# Altium schematic sheet Digital_Connectors_and_IHM.SchDoc
size A3; SheetNumber: 3; SheetTotal: 4; SPICEModelCachePRCXJTIU: <root> / <DocumentId>PRCXJTIU</DocumentId> / </root>
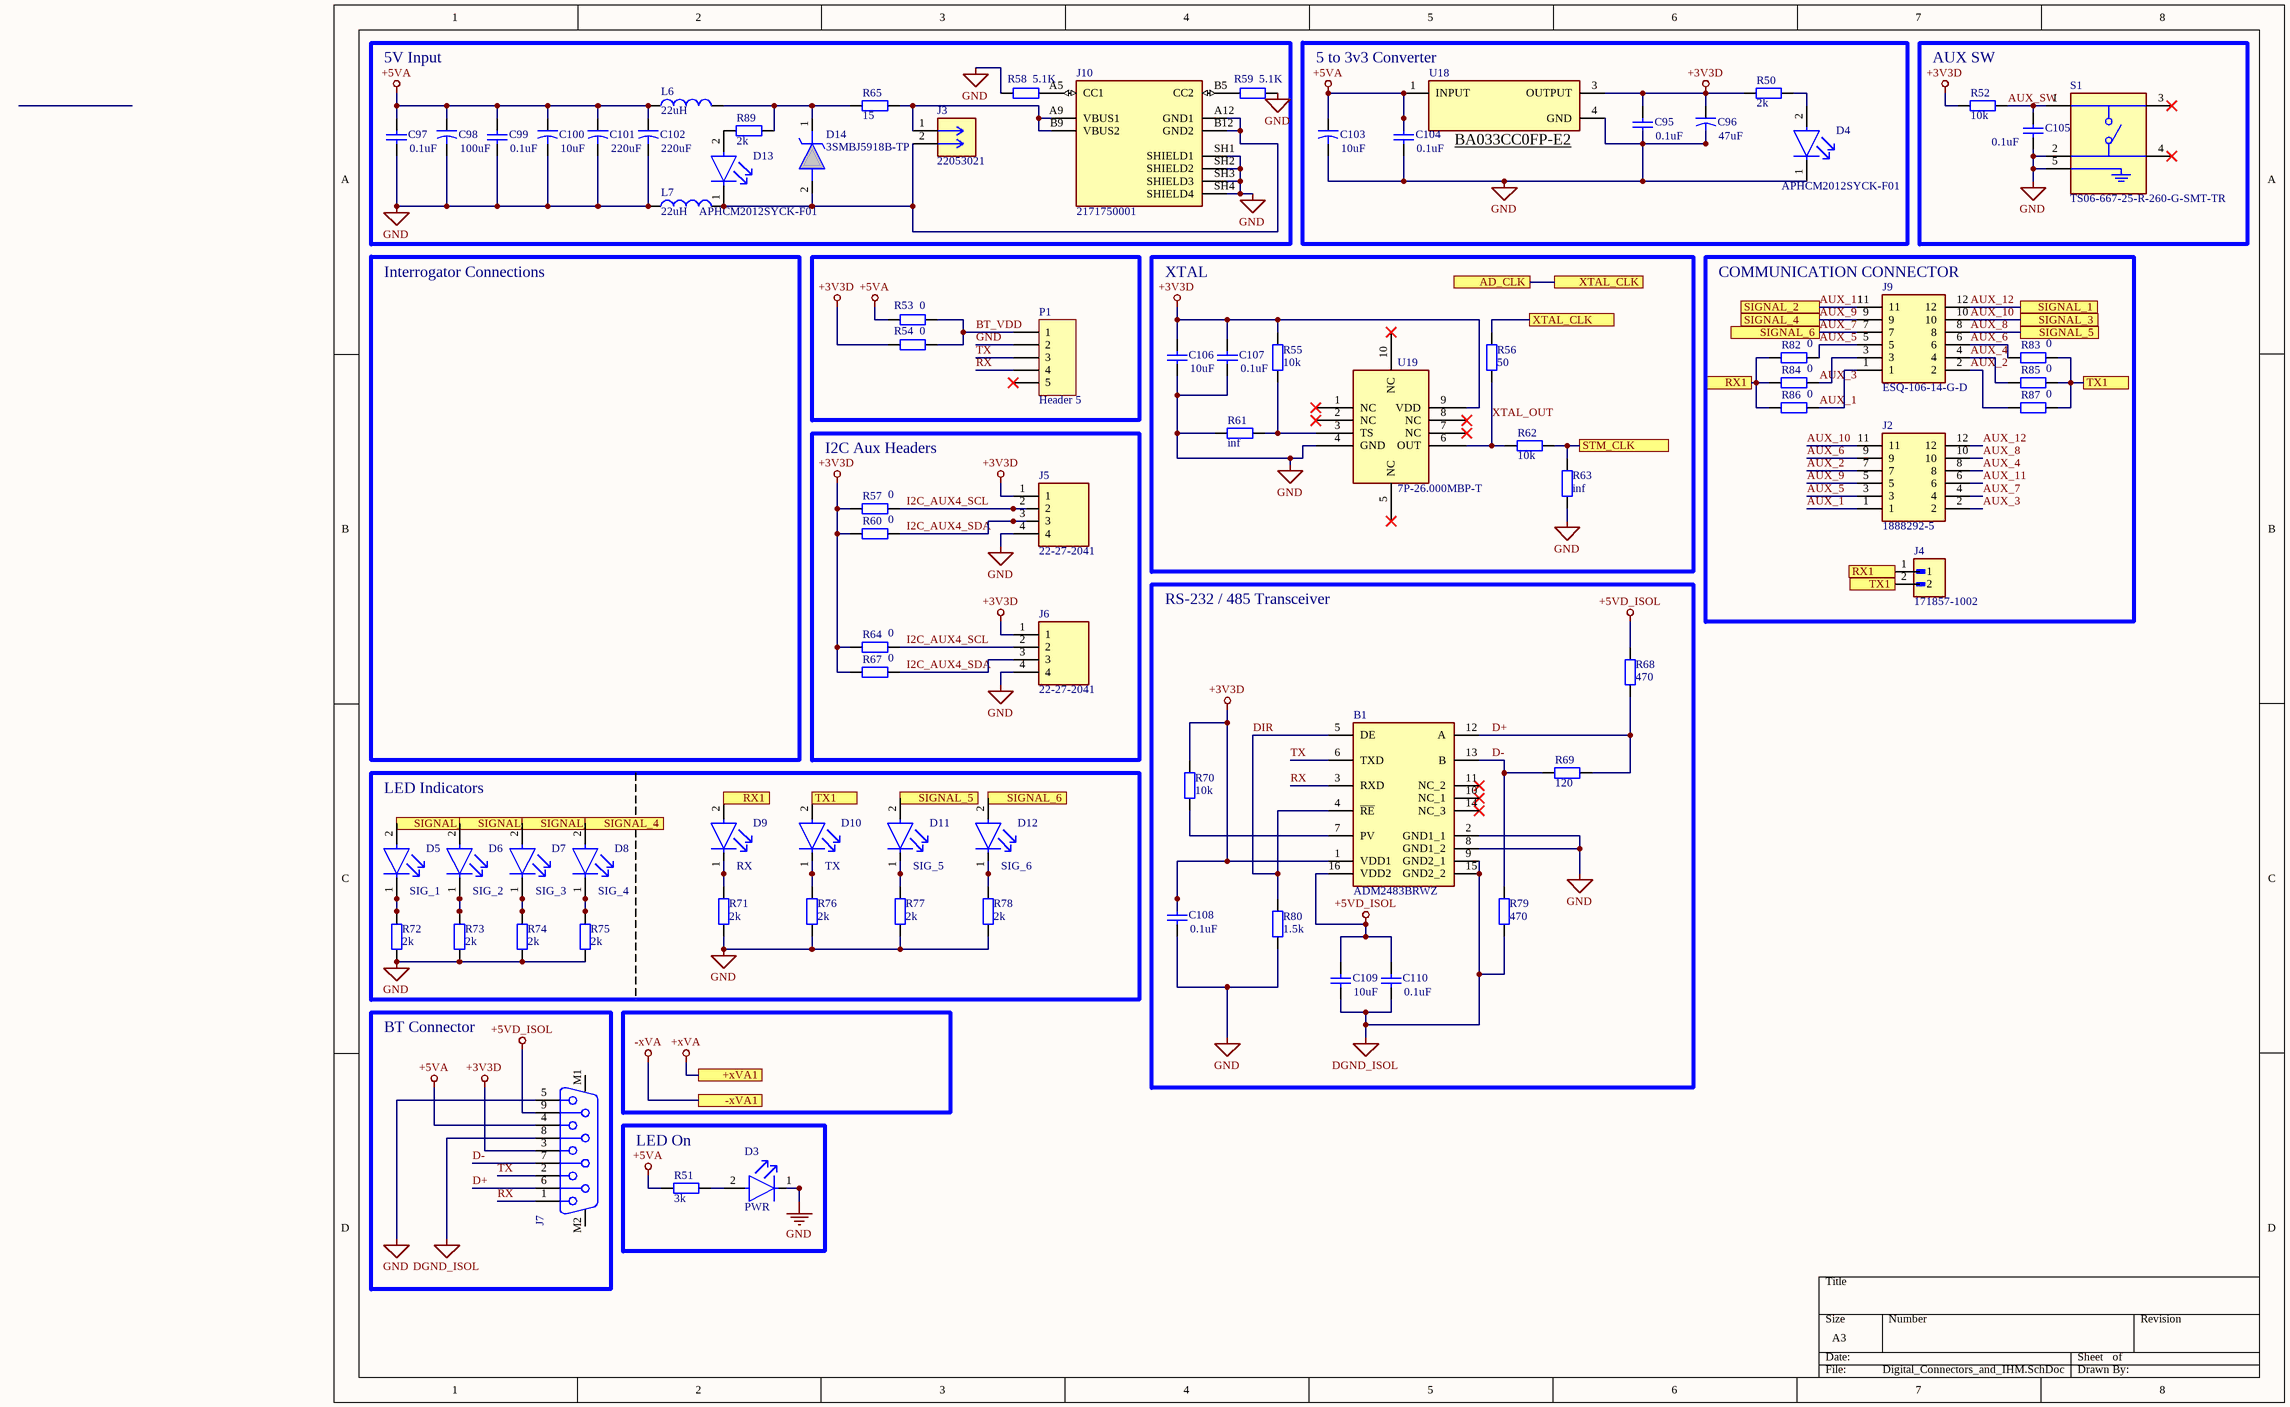
[diagram p0: Digital_Connectors_and_IHM.SchDoc]

## Parts
B1  ADM2483BRWZ  [ADM2483BRWZ]
C95  value 0.1uF  [CC_0805]  (hidden comment: Cap)
C96  value 47uF  [CC_0805]  (hidden comment: Cap2)
C97  value 0.1uF  [CC_0805]  (hidden comment: Cap)
C98  value 100uF  [CC_0805]  (hidden comment: Cap2)
C99  value 0.1uF  [CC_0805]  (hidden comment: Cap)
C100  value 10uF  [CC_0805]  (hidden comment: Cap2)
C101  value 220uF  [CC_0805]  (hidden comment: Cap2)
C102  value 220uF  [CC_0805]  (hidden comment: Cap2)
C103  value 10uF  [CC_0805]  (hidden comment: Cap2)
C104  value 0.1uF  [CC_0805]  (hidden comment: Cap)
C105  value 0.1uF  [CC_0805]  (hidden comment: Cap)
C106  value 10uF  [CC_0805]  (hidden comment: Cap)
C107  value 0.1uF  [CC_0805]  (hidden comment: Cap)
C108  value 0.1uF  [CC_0805]  (hidden comment: Cap)
C109  value 10uF  [CC_0805]  (hidden comment: Cap)
C110  value 0.1uF  [CC_0805]  (hidden comment: Cap)
D3  PWR  [FP-APHCM2012SYCK-F01-MFG]
D4  APHCM2012SYCK-F01  [FP-APHCM2012SYCK-F01-MFG]
D5  SIG_1  [FP-APHCM2012SYCK-F01-MFG]
D6  SIG_2  [FP-APHCM2012SYCK-F01-MFG]
D7  SIG_3  [FP-APHCM2012SYCK-F01-MFG]
D8  SIG_4  [FP-APHCM2012SYCK-F01-MFG]
D9  RX  [FP-APHCM2012SYCK-F01-MFG]
D10  TX  [FP-APHCM2012SYCK-F01-MFG]
D11  SIG_5  [FP-APHCM2012SYCK-F01-MFG]
D12  SIG_6  [FP-APHCM2012SYCK-F01-MFG]
D13  APHCM2012SYCK-F01  [FP-APHCM2012SYCK-F01-MFG]
D14  3SMBJ5918B-TP  [3SMBJ5918B-TP]
J2  1888292-5  [TE_1888292-5]
J3  22053021  [22-05-3021]
J4  171857-1002  [MOLEX_171857-1002]
J5  22-27-2041  [22-27-2041]
J6  22-27-2041  [22-27-2041]
J7  618009231121  [618009231121]  (value not drawn)
J9  ESQ-106-14-G-D  [ESQ-106-Y-X-D]
J10  2171750001  [MOLEX_2171750001]
L6  value 22uH  [WE-PMI_0805_H0.5]  (hidden comment: Inductor)
L7  value 22uH  [WE-PMI_0805_H0.5]  (hidden comment: Inductor)
P1  Header 5  [HDR1X5]
R50  value 2k  [RR_1220]  (hidden comment: Res2)
R51  value 3k  [RR_1220]  (hidden comment: Res2)
R52  value 10k  [RR_1220]  (hidden comment: Res2)
R53  value 0  [RR_1220]  (hidden comment: Res2)
R54  value 0  [RR_1220]  (hidden comment: Res2)
R55  value 10k  [RR_1220]  (hidden comment: Res2)
R56  value 50  [RR_1220]  (hidden comment: Res2)
R57  value 0  [RR_1220]  (hidden comment: Res2)
R58  value 5.1K  [RR_1220]  (hidden comment: Res2)
R59  value 5.1K  [RR_1220]  (hidden comment: Res2)
R60  value 0  [RR_1220]  (hidden comment: Res2)
R61  value inf  [RR_1220]  (hidden comment: Res2)
R62  value 10k  [RR_1220]  (hidden comment: Res2)
R63  value inf  [RR_1220]  (hidden comment: Res2)
R64  value 0  [RR_1220]  (hidden comment: Res2)
R65  value 15  [RR_1220]  (hidden comment: Res2)
R67  value 0  [RR_1220]  (hidden comment: Res2)
R68  value 470  [RR_1220]  (hidden comment: Res2)
R69  value 120  [RR_1220]  (hidden comment: Res2)
R70  value 10k  [RR_1220]  (hidden comment: Res2)
R71  value 2k  [RR_1220]  (hidden comment: Res2)
R72  value 2k  [RR_1220]  (hidden comment: Res2)
R73  value 2k  [RR_1220]  (hidden comment: Res2)
R74  value 2k  [RR_1220]  (hidden comment: Res2)
R75  value 2k  [RR_1220]  (hidden comment: Res2)
R76  value 2k  [RR_1220]  (hidden comment: Res2)
R77  value 2k  [RR_1220]  (hidden comment: Res2)
R78  value 2k  [RR_1220]  (hidden comment: Res2)
R79  value 470  [RR_1220]  (hidden comment: Res2)
R80  value 1.5k  [RR_1220]  (hidden comment: Res2)
R82  value 0  [RR_1220]  (hidden comment: Res2)
R83  value 0  [RR_1220]  (hidden comment: Res2)
R84  value 0  [RR_1220]  (hidden comment: Res2)
R85  value 0  [RR_1220]  (hidden comment: Res2)
R86  value 0  [RR_1220]  (hidden comment: Res2)
R87  value 0  [RR_1220]  (hidden comment: Res2)
R89  value 2k  [RR_1220]  (hidden comment: Res2)
S1  TS06-667-25-R-260-G-SMT-TR  [TS06-667-25-R-260-G-SMT-TR]
U18  TLV2217-33KVURG3  [FP-KVU0003A-MFG]  (value not drawn)
U19  7P-26.000MBP-T  [7P26000MBPT]

## Blocks framed on the sheet
5V Input: C97-C102 D13 D14 J3 J10 L6 L7 R58 R59 R65 R89
AUX SW: C105 R52 S1
XTAL: C106 C107 R55 R56 R61-R63 U19
COMMUNICATION CONNECTOR: J2 J4 J9 R82-R87
I2C Aux Headers: J5 J6 R57 R60 R64 R67
RS-232 / 485 Transceiver: B1 C108-C110 R68-R70 R79 R80
LED Indicators: D5-D12 R71-R78
BT Connector: J7
LED On: D3 R51

## Ports
+xVA1, -xVA1, AD_CLK (see Analog_Supply_and_TIA[5C], Digital_STMG474RE[3B]), RX1 (see Digital_Connectors_and_IHM[2C], Digital_Connectors_and_IHM[6B], Digital_STMG474RE[4B]), RX1 (see Digital_Connectors_and_IHM[2C], Digital_Connectors_and_IHM[7B], Digital_STMG474RE[4B]), RX1 (see Digital_Connectors_and_IHM[6B], Digital_Connectors_and_IHM[7B], Digital_STMG474RE[4B]), SIGNAL_1 (see Digital_Connectors_and_IHM[1C], Digital_STMG474RE[5B]), SIGNAL_1 (see Digital_Connectors_and_IHM[7A], Digital_STMG474RE[5B]), SIGNAL_2 (see Digital_Connectors_and_IHM[1C], Digital_STMG474RE[5B]), SIGNAL_2 (see Digital_Connectors_and_IHM[6A], Digital_STMG474RE[5B]), SIGNAL_3 (see Digital_Connectors_and_IHM[1C], Digital_STMG474RE[5B]), SIGNAL_3 (see Digital_Connectors_and_IHM[7A], Digital_STMG474RE[5B]), SIGNAL_4 (see Digital_Connectors_and_IHM[2C], Digital_STMG474RE[5B]), SIGNAL_4 (see Digital_Connectors_and_IHM[6A], Digital_STMG474RE[5B]), SIGNAL_5 (see Digital_Connectors_and_IHM[3C], Digital_STMG474RE[3A]), SIGNAL_5 (see Digital_Connectors_and_IHM[7A], Digital_STMG474RE[3A]), SIGNAL_6 (see Digital_Connectors_and_IHM[3C], Digital_STMG474RE[3A]), SIGNAL_6 (see Digital_Connectors_and_IHM[6A], Digital_STMG474RE[3A]), STM_CLK (see Digital_STMG474RE[5B]), TX1 (see Digital_Connectors_and_IHM[2C], Digital_Connectors_and_IHM[7B], Digital_STMG474RE[4A]), TX1 (see Digital_Connectors_and_IHM[2C], Digital_Connectors_and_IHM[8B], Digital_STMG474RE[4A]), TX1 (see Digital_Connectors_and_IHM[7B], Digital_Connectors_and_IHM[8B], Digital_STMG474RE[4A]), XTAL_CLK (see Digital_Connectors_and_IHM[5A]), XTAL_CLK (see Digital_Connectors_and_IHM[6A])

## Nets
+3V3D: B1.1(VDD1) C95.2 C96.1 C106.2 C107.2 C108.2 J5.1 J6.1 J7.3 R50.1 R52.1 R54.1 R55.2 R57.1 R60.1 R64.1 R67.1 R70.1 U18.3(OUTPUT) U19.9(VDD)
+5VA: C97.2 C98.1 C99.2 C100.1 C101.1 C102.1 C103.1 C104.2 J7.4 L6.1 R51.2 R53.1 U18.1(INPUT)
+5VD_ISOL: B1.16(VDD2) C109.2 C110.2 J7.9 R68.1
+xVA: port +xVA1
-xVA: port -xVA1
DGND_ISOL: B1.9(GND2_1) B1.15(GND2_2) C109.1 C110.1 J7.8 R79.2
GND: B1.2(GND1_1) B1.8(GND1_2) C95.1 C96.2 C97.1 C98.2 C99.1 C100.2 C101.2 C102.2 C103.2 C104.1 C105.1 C106.1 C107.1 C108.1 D3.1(C) D4.1(C) J5.4 J6.4 J7.5 J10.SH1(SHIELD1) J10.SH2(SHIELD2) J10.SH3(SHIELD3) J10.SH4(SHIELD4) L7.1 P1.2 R58.1 R59.2 R61.1 R63.2 R71.2 R72.1 R73.1 R74.1 R75.1 R76.2 R77.1 R78.1 R80.2 S1.2 S1.5 U18.4(GND) U19.4(GND)
AD_CLK: R56.2 ; port XTAL_CLK, port AD_CLK
AUX_1: J2.1 J9.1 R86.2
AUX_2: J2.7 J9.2 R87.1
AUX_3: J2.2 J9.3 R84.2
AUX_4: J2.8 J9.4 R85.1
AUX_5: J2.3 J9.5 R82.2
AUX_6: J2.9 J9.6 R83.1
AUX_7: D12.2(A) J2.4 J9.7 ; port SIGNAL_6
AUX_8: D11.2(A) J2.10 J9.8 ; port SIGNAL_5
AUX_9: D8.2(A) J2.5 J9.9 ; port SIGNAL_4
AUX_10: D7.2(A) J2.11 J9.10 ; port SIGNAL_3
AUX_11: D6.2(A) J2.6 J9.11 ; port SIGNAL_2
AUX_12: D5.2(A) J2.12 J9.12 ; port SIGNAL_1
AUX_SW: C105.2 R52.2 S1.1
BT_VDD: P1.1 R53.2 R54.2
D+: B1.12(A) J7.6 R68.2 R69.1
D-: B1.13(B) J7.7 R69.2 R79.1
DIR: B1.4(~{RE}) B1.5(DE) R80.1
I2C_AUX4_SCL: J5.2 J6.2 R57.2 R64.2
I2C_AUX4_SDA: J5.3 J6.3 R60.2 R67.2
RX: B1.3(RXD) J7.1 P1.4
RX1: D9.2(A) J4.1 R82.1 R84.1 R86.1 ; port RX1
STM_CLK: R62.1 R63.1 ; port STM_CLK
TX: B1.6(TXD) J7.2 P1.3
TX1: D10.2(A) J4.2 R83.2 R85.2 R87.2 ; port TX1
XTAL_OUT: R56.1 R62.2 U19.6(OUT)
NetB1_7: B1.7(PV) R70.2
NetD3_2: D3.2(A) R51.1
NetD4_2: D4.2(A) R50.2
NetD5_1: D5.1(C) R72.2
NetD6_1: D6.1(C) R73.2
NetD7_1: D7.1(C) R74.2
NetD8_1: D8.1(C) R75.2
NetD9_1: D9.1(C) R71.1
NetD10_1: D10.1(C) R76.1
NetD11_1: D11.1(C) R77.2
NetD12_1: D12.1(C) R78.2
NetD13_1: D13.1(C) D14.2(A) J3.2 J10.A12(GND1) J10.B12(GND2) L7.2
NetD13_2: D13.2(A) R89.2
NetD14_1: D14.1(K) L6.2 R65.2 R89.1
NetJ3_1: J3.1 J10.A9(VBUS1) J10.B9(VBUS2) R65.1
NetJ10_A5: J10.A5(CC1) R58.2
NetJ10_B5: J10.B5(CC2) R59.1
NetR55_1: R55.1 R61.2 U19.3(TS)

Not connected (* = marked no-connect by the designer): B1 10(NC_1)* 11(NC_2)* 14(NC_3)*; J7 M1 M2; P1 5*; S1 3* 4*; U19 1(NC)* 2(NC)* 5(NC)* 7(NC)* 8(NC)* 10(NC)*

## Notes on the sheet
- (near U18) 5 to 3v3 Converter
- (near U18) BA033CC0FP-E2
- Interrogator Connections

## Library data of the parts
B1 = ADM2483BRWZ: Half-Duplex, iCoupler Isolated RS-485 Transceiver; Manufacturer_Name: Analog Devices; Geometry.Height: 2.65mm; Manufacturer_Part_Number: ADM2483BRWZ; Mouser Part Number: 584-ADM2483BRWZ; Mouser Price/Stock: https://www.mouser.co.uk/ProductDetail/Analog-Devices/ADM2483BRWZ?qs=BpaRKvA4VqH5Kim10agOlw%3D%3D; Arrow Part Number: ADM2483BRWZ; Arrow Price/Stock: https://www.arrow.com/en/products/adm2483brwz/analog-devices?utm_currency=USD&region=europe; Datasheet Link: http://uk.rs-online.com/web/p/products/0412719P
C95 C97 C99 C104-C110 = Cap: Capacitor; Published: 8-Jun-2000; LatestRevisionDate: 17-Jul-2002; LatestRevisionNote: Re-released for DXP Platform.; PackageReference: RAD-0.3; Publisher: Altium Limited; PackageDescription: Radial Cap, Thru-Hole; 2 Leads; 0.3 in Pin Spacing
C96 C98 C100-C103 = Cap2: Capacitor; Published: 23-Sep-2002; PackageReference: CAPR5-4X5; Publisher: Altium Limited; PackageDescription: Capacitor; 2 Leads
D3-D13 = CMP-44529-000064-1: LED YELLOW CLEAR CHIP SMD; Number of LEDs: 1; Luminous Intensity: 150mcd; Dominant Wavelength: 590nm; Test Current: 20mA; Illumination Color: Green; Forward Voltage: 2V; Viewing Angle: 110°; Number of Pins: 2; Packaging: Tape and Reel; Width: 1.25mm; Height: 0.4mm; Lens Color: Clear; RoHS Compliant: Yes; Lead Free: Lead Free; Min Operating Temperature: -40°C; Case Code (Imperial): 0805; Case/Package: 0805; Series: APHCM; Wavelength: 590nm; Max Operating Temperature: 85°C; Length: 2mm; Color: Yellow; Package Quantity: 2000; Mount: Surface Mount; Lens Style: Clear; Forward Current: 20mA; Case Code (Metric): 2012
D14 = 3SMBJ5918B-TP: Zener Diodes; Manufacturer_Name: MCC; Geometry.Height: 2.62mm; Manufacturer_Part_Number: 3SMBJ5918B-TP; Mouser Part Number: 833-3SMBJ5918B-TP; Mouser Price/Stock: https://www.mouser.com/Search/Refine.aspx?Keyword=833-3SMBJ5918B-TP; Arrow Part Number: 3SMBJ5918B-TP; Arrow Price/Stock: https://www.arrow.com/en/products/3smbj5918b-tp/micro-commercial-components; Datasheet Link: https://www.mccsemi.com/pdf/Products/3SMBJ5918B-3SMBJ5956B(SMB).pdf
J2 = 1888292-5: 12 Position, Elevated Socket Strip, 0.100&quot; Pitch; Manufacturer_Name: SAMTEC; Manufacturer_Part_Number: ESQ-106-14-G-D; Mouser Part Number: 200-ESQ10614GD; Mouser Price/Stock: https://www.mouser.co.uk/ProductDetail/Samtec/ESQ-106-14-G-D?qs=0lQeLiL1qybkPQShhYifng%3D%3D; Arrow Part Number: *; Arrow Price/Stock: *; Datasheet Link: http://suddendocs.samtec.com/prints/esq-1xx-xx-x-x-xxx-xx-x-xx-mkt.pdf
J4 = 171857-1002: MF: {'manufacturer': u'Molex'}; Package: None; Price: None; Value: *; MP: 171857-1002; Availability: Unavailable
J5 J6 = 22-27-2041: Headers & Wire Housings 4 POS HEADER; Manufacturer_Name: Molex; Geometry.Height: 11.7mm; Manufacturer_Part_Number: 22-27-2041; Mouser Part Number: 538-22-27-2041; Mouser Price/Stock: https://www.mouser.co.uk/ProductDetail/Molex/22-27-2041?qs=hSmm4fxMIuMKVUQkn4wbYQ%3D%3D; Arrow Part Number: *; Arrow Price/Stock: *; Datasheet Link: https://www.molex.com/pdm_docs/sd/022272041_sd.pdf
J7 = 618009231121: WR-DSUB 8.08mm Female PCB Connector with Hex Screw, THT, Angled, 9p; Manufacturer: Wurth Elektronik; Contact Resistance: 30mΩ; Rated Current: 3A; Working Voltage: 125VAC; Withstanding Voltage: 1000VAC; Manufacturer Part Number: 618009231121; Category: Input/Output Connector; Match Code: WR-DSUB; ComponentLink1Description: Website Link; ComponentLink1URL: https://www.we-online.com/redexpert/article/618009231121?ad; ComponentLink2Description: Datasheet Link; ComponentLink2URL: https://www.we-online.com/redexpert/spec/618009231121?ad; Mount: Through Hole; Min Operating Temperature: -55°C; Max Operating Temperature: 105°C; Packaging: Tray; Gender: Female; Number of Pins: 9; Orientation: Angled
J9 = ESQ-106-14-G-D: 12 Position, Elevated Socket Strip, 0.100&quot; Pitch; Manufacturer_Name: SAMTEC; Manufacturer_Part_Number: ESQ-106-14-G-D; Mouser Part Number: 200-ESQ10614GD; Mouser Price/Stock: https://www.mouser.co.uk/ProductDetail/Samtec/ESQ-106-14-G-D?qs=0lQeLiL1qybkPQShhYifng%3D%3D; Arrow Part Number: *; Arrow Price/Stock: *; Datasheet Link: http://suddendocs.samtec.com/prints/esq-1xx-xx-x-x-xxx-xx-x-xx-mkt.pdf
J10 = 2171750001: USB-C (USB TYPE-C) USB 2.0 Receptacle Connector 24 (6+18 Dummy) Position Surface Mount, Right Angle; Through Hole; MF: Molex; SnapEDA_Link: https://www.snapeda.com/parts/2171750001/Molex/view-part/?ref=snap; Package: None; Value: *; MP: 2171750001; Check_prices: https://www.snapeda.com/parts/2171750001/Molex/view-part/?ref=eda
L6 L7 = Inductor: Code_IEC: 1005; Published: 8-Jun-2000; LatestRevisionDate: 29-May-2009; LatestRevisionNote: IPC-7351 Footprint Added.; PackageReference: 0402-A; Publisher: Altium Limited; PackageDescription: Chip Inductor; Code_JEITA: 0402
P1 = Header 5: Header, 5-Pin; LatestRevisionDate: 17-Jul-2002; LatestRevisionNote: Re-released for DXP Platform.; Publisher: Altium Limited
R50-R65 R67-R80 R82-R87 R89 = Res2: Resistor; Published: 8-Jun-2000; LatestRevisionDate: 17-Jul-2002; LatestRevisionNote: Re-released for DXP Platform.; PackageReference: AXIAL-0.4; Publisher: Altium Limited; PackageDescription: Axial Device, Thru-Hole; 2 Leads; 0.4 in Pin Spacing
S1 = TS06-667-25-R-260-G-SMT-TR: 6 x 6.7 mm, 2.5 mm Actuator Height, 260 gf, Red, Surface Mount, SPST, Tactile Switch; MF: Same Sky; SnapEDA_Link: https://www.snapeda.com/parts/TS06-667-25-R-260-G-SMT-TR/Same+Sky/view-part/?ref=snap; Package: None; Value: *; MP: TS06-667-25-R-260-G-SMT-TR; Check_prices: https://www.snapeda.com/parts/TS06-667-25-R-260-G-SMT-TR/Same+Sky/view-part/?ref=eda
U18 = CMP-04917-000319-1: IC REG LINEAR 3.3V 500MA TO252-3; Number of Outputs: 1; Max Input Voltage: 12V; Min Input Voltage: 3V; Polarity: Positive; Dropout Voltage: 500mV; Output Type: Fixed; Output Voltage Accuracy: 1%; Quiescent Current: 290uA; Case/Package: TO-252; Radiation Hardening: No; Min Operating Temperature: 0°C; Output Current: 500mA; Package Quantity: 1; Packaging: Cut Tape; Mount: Surface Mount; Lead Free: Lead Free; RoHS Compliant: Yes; Contact Plating: Tin; Series: -; Nominal Output Voltage: 3.3V; Number of Pins: 3; REACH SVHC: No SVHC; Max Operating Temperature: 125°C; Number of Regulators: 1; Output Voltage: 3.3V; Input Bias Current: 290uA; Accuracy: 1%; Max Output Current: 500mA
J3 = 22053021: Package: None; Price: None; Value: *; MP: 22053021; Availability: Unavailable